# Altium schematic sheet MCU_Power.SchDoc
size A4; SheetNumber: 3; SheetTotal: 4
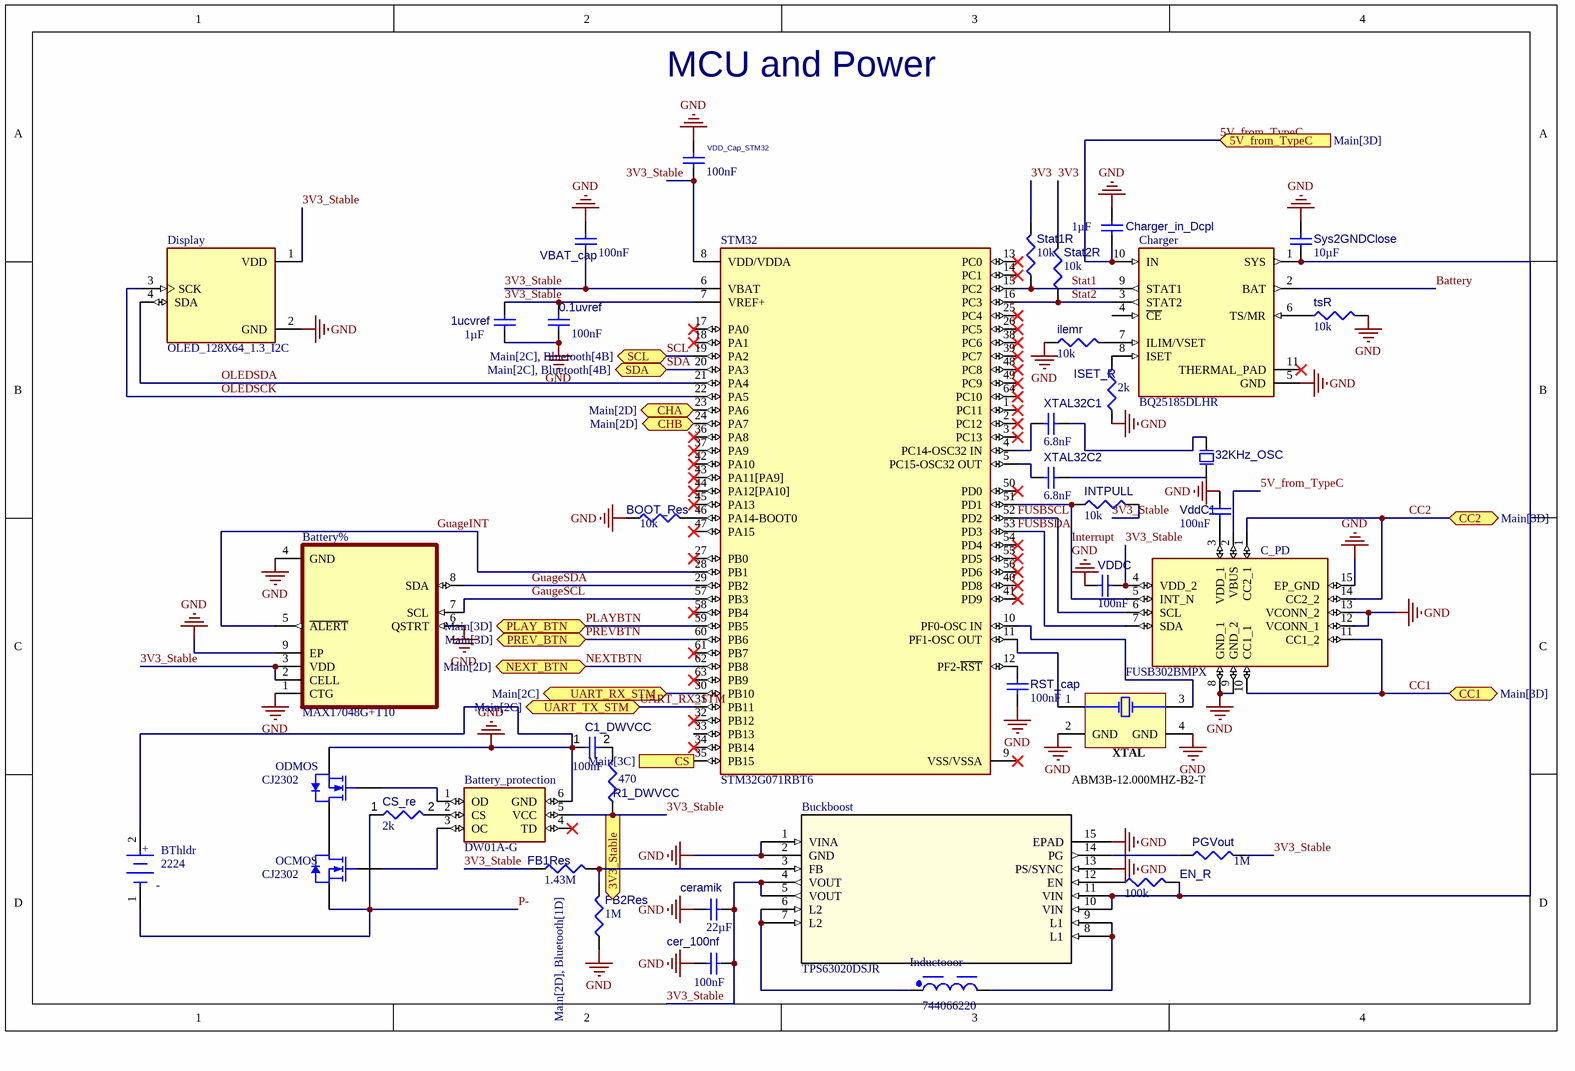
[diagram p0: MCU_Power.SchDoc]

## Parts
0.1uvref  value 100nF  [CAPC0402(1005)60_L]  (hidden comment: Capacitor 100nF +/-20% 10V 0402)
1ucvref  value 1µF  [CAPC2013X145X50ML20T25]  (hidden comment: Capacitor 1 uF +/- 10% 25 V 0805)
32KHz_OSC  ABS07-166-32.768KHZ-T  [EPSON-FC-135_V]  (value not drawn)
Battery%  MAX17048G+T10  [SON50P200X200X80-9N]
Battery_protection  DW01A-G  [SOT95P280X135-6N]
BOOT_Res  value 10k  [RESC0402(1005)_L]  (hidden comment: 10KR2F)
BThldr  2224  [FP-2224-MFG]
Buckboost  TPS63020DSJR  [IC_TPS63020DSJR]
C1_DWVCC  value 100nF  [CAPC0402(1005)60_L]  (hidden comment: Capacitor 100nF +/-20% 10V 0402)
C_PD  FUSB302BMPX  [QFN50P250X250X80-15N]
cer_100nf  value 100nF  [CAPC0402(1005)60_L]  (hidden comment: Capacitor 100nF +/-20% 50V 0402)
ceramik  value 22µF  [CAPC0805(2012)145_L]  (hidden comment: Capacitor 22µF +/-40% 16V 0805)
Charger  BQ25185DLHR  [IC_BQ25185DLHR]
Charger_in_Dcpl  value 1µF  [CAPC1005X55X25ML5T10]  (hidden comment: Capacitor 1 uF +/- 10% 6.3 V 1005)
CS_re  value 2k  [RESC0402(1005)_L]  (hidden comment: Resistor 2K +/-5 % 0402 63 mW)
Display  OLED_128X64_1.3_I2C  [LCD_OLED_128X64_1.3_I2C]
EN_R  value 100k  [RESC0402(1005)_L]  (hidden comment: 100KR2F)
FB1Res  value 1.43M  [RESC0402(1005)_L]  (hidden comment: Resistor 1M +/-1 % 0402 63 mW)
FB2Res  value 1M  [RESC0402(1005)_L]  (hidden comment: Resistor 1M +/-1 % 0402 63 mW)
ilemr  value 10k  [RESC0402(1005)_L]  (hidden comment: 10KR2F)
Inductooor  744066220  [WE-TPC_1038]
INTPULL  value 10k  [RESC0402(1005)_L]  (hidden comment: 10KR2F)
ISET_R  value 2k  [RESC0402(1005)_L]  (hidden comment: 2KR2J)
OCMOS  CJ2302  [JSCJ-SOT23-3_V]
ODMOS  CJ2302  [JSCJ-SOT23-3_V]
PGVout  value 1M  [RESC0402(1005)_L]  (hidden comment: Resistor 1M +/-1 % 0402 63 mW)
R1_DWVCC  value 470  [RESC0805(2012)_L]  (hidden comment: 470R5J)
RST_cap  value 100nF  [CAPC0402(1005)60_L]  (hidden comment: Capacitor 100nF +/-20% 10V 0402)
Stat1R  value 10k  [RESC0402(1005)_L]  (hidden comment: 10KR2F)
Stat2R  value 10k  [RESC0402(1005)_L]  (hidden comment: 10KR2F)
STM32  STM32G071RBT6  [FP-LQFP64-5W-IPC_C]
Sys2GNDClose  value 10µF  [CAPC3216X180X50NL20T25]  (hidden comment: Capacitor 10 uF +/- 10% 16 V 1206)
tsR  value 10k  [RESC0402(1005)_L]  (hidden comment: 10KR2F)
VBAT_cap  value 100nF  [CAPC0402(1005)60_L]  (hidden comment: Capacitor 100nF +/-20% 10V 0402)
VDD_Cap_STM32  value 100nF  [CAPC0402(1005)60_L]  (hidden comment: Capacitor 100nF +/-20% 10V 0402)
VDDC  value 100nF  [CAPC0402(1005)60_L]  (hidden comment: Capacitor 100nF +/-20% 10V 0402)
VddC1  value 100nF  [CAPC0402(1005)60_L]  (hidden comment: Capacitor 100nF +/-20% 10V 0402)
XTAL  ABM3B-12.000MHZ-B2-T  [ABRA-ABM3B-4_V]
XTAL32C1  value 6.8nF  [CAPC1005X56X25NL10T15]  (hidden comment: Capacitor 6.8 nF +/- 10% 16 V 0402)
XTAL32C2  value 6.8nF  [CAPC1005X56X25NL10T15]  (hidden comment: Capacitor 6.8 nF +/- 10% 16 V 0402)

## Ports
3V3_Stable (out, see Main[2D], Bluetooth[1D]), 5V_from_TypeC (in, see Main[3D]), CC1 (bidir, see Main[3D]), CC2 (bidir, see Main[3D]), CHA (bidir, see Main[2D]), CHB (bidir, see Main[2D]), CS (out, see Main[3C]), NEXT_BTN (bidir, see Main[2D]), PLAY_BTN (bidir, see Main[3D]), PREV_BTN (bidir, see Main[3D]), SCL (bidir, see Main[2C], Bluetooth[4B]), SDA (bidir, see Main[2C], Bluetooth[4B]), UART_RX_STM (bidir, see Main[2C]), UART_TX_STM (bidir, see Main[2C])

## Nets
GND: 0.1uvref.1 1ucvref.1 Battery%.1(CTG) Battery%.4(GND) Battery%.6(QSTRT) Battery%.9(EP) Battery_protection.6(GND) BOOT_Res.1 BThldr.2(A) Buckboost.1(VINA) Buckboost.2(GND) Buckboost.13(PS/SYNC) Buckboost.15(EPAD) C1_DWVCC.1 C_PD.8(GND_1) C_PD.9(GND_2) C_PD.12(VCONN_1) C_PD.13(VCONN_2) C_PD.15(EP_GND) cer_100nf.1 ceramik.1 Charger.5(GND) Charger_in_Dcpl.2 Display.2(GND) FB2Res.1 ilemr.1 ISET_R.1 ODMOS.2(S) RST_cap.2 Sys2GNDClose.2 tsR.2 VBAT_cap.2 VDD_Cap_STM32.2 VDDC.1 VddC1.2 XTAL.2(GND) XTAL.4(GND)
3V3: Stat1R.2 Stat2R.2
3V3_Stable: 0.1uvref.2 1ucvref.2 Battery%.2(CELL) Battery%.3(VDD) Battery_protection.5(VCC) Buckboost.4(VOUT) Buckboost.5(VOUT) C_PD.4(VDD_2) cer_100nf.2 ceramik.2 Display.1(VDD) FB1Res.1 INTPULL.2 PGVout.2 R1_DWVCC.1 STM32.6(VBAT) STM32.7(VREF+) VBAT_cap.1 VDDC.2 ; port 3V3_Stable
5V_from_TypeC: C_PD.2(VBUS) Charger.10(IN) Charger_in_Dcpl.1 ; port 5V_from_TypeC
Battery: Charger.2(BAT)
CC1: C_PD.10(CC1_1) C_PD.11(CC1_2) ; port CC1
CC2: C_PD.1(CC2_1) C_PD.14(CC2_2) ; port CC2
CHA: STM32.23(PA6) ; port CHA
CHB: STM32.24(PA7) ; port CHB
CS: STM32.35(PB15) ; port CS
FUSBSCL: C_PD.6(SCL) STM32.52(PD2)
FUSBSDA: C_PD.7(SDA) STM32.53(PD3)
GaugeSCL: Battery%.7(SCL) STM32.57(PB3)
GuageINT: Battery%.5(~{ALERT}) STM32.28(PB1)
GuageSDA: Battery%.8(SDA) STM32.29(PB2)
Interrupt: C_PD.5(INT_N) INTPULL.1 STM32.51(PD1)
NEXTBTN: STM32.62(PB8) ; port NEXT_BTN
OLEDSCK: Display.3(SCK) STM32.22(PA5)
OLEDSDA: Display.4(SDA) STM32.21(PA4)
P-: BThldr.1(C) CS_re.1 OCMOS.2(S)
PLAYBTN: STM32.59(PB5) ; port PLAY_BTN
PREVBTN: STM32.60(PB6) ; port PREV_BTN
SCL: STM32.19(PA2) ; port SCL
SDA: STM32.20(PA3) ; port SDA
Stat1: Charger.9(STAT1) Stat1R.1 STM32.15(PC2)
Stat2: Charger.3(STAT2) Stat2R.1 STM32.16(PC3)
UART_RX_STM: STM32.30(PB10) ; port UART_RX_STM
UART_RX_STM: STM32.31(PB11) ; port UART_TX_STM  [a separate net that carries the same name]
Net32KHz_OSC_1: 32KHz_OSC.1 XTAL32C2.2
Net32KHz_OSC_2: 32KHz_OSC.2 XTAL32C1.2
NetBattery_protection_1: Battery_protection.1(OD) ODMOS.1(G)
NetBattery_protection_2: Battery_protection.2(CS) CS_re.2
NetBattery_protection_3: Battery_protection.3(OC) OCMOS.1(G)
NetBOOT_Res_2: BOOT_Res.2 STM32.46(PA14-BOOT0)
NetBuckboost_3: Buckboost.3(FB) FB1Res.2 FB2Res.2
NetBuckboost_6: Buckboost.6(L2) Buckboost.7(L2) Inductooor.1
NetBuckboost_8: Buckboost.8(L1) Buckboost.9(L1) Inductooor.2
NetBuckboost_10: Buckboost.10(VIN) Buckboost.11(VIN) Charger.1(SYS) EN_R.2 Sys2GNDClose.1
NetBuckboost_12: Buckboost.12(EN) EN_R.1
NetBuckboost_14: Buckboost.14(PG) PGVout.1
NetC1_DWVCC_2: C1_DWVCC.2 R1_DWVCC.2
NetC_PD_3: C_PD.3(VDD_1) VddC1.1
NetCharger_6: Charger.6(TS/MR) tsR.1
NetCharger_7: Charger.7(ILIM/VSET) ilemr.2
NetCharger_8: Charger.8(ISET) ISET_R.2
NetOCMOS_3: OCMOS.3(D) ODMOS.3(D)
NetRST_cap_1: RST_cap.1 STM32.12(PF2-~{RST})
NetSTM32_4: STM32.4(PC14-OSC32_IN) XTAL32C1.1
NetSTM32_5: STM32.5(PC15-OSC32_OUT) XTAL32C2.1
NetSTM32_8: STM32.8(VDD/VDDA) VDD_Cap_STM32.1
NetSTM32_10: STM32.10(PF0-OSC_IN) XTAL.3(X2)
NetSTM32_11: STM32.11(PF1-OSC_OUT) XTAL.1(X1)

Not connected (* = marked no-connect by the designer): Battery_protection 4(TD)*; Charger 4(~{CE}) 11(THERMAL_PAD)*; STM32 1(PC11)* 2(PC12)* 3(PC13)* 9(VSS/VSSA)* 13(PC0)* 14(PC1)* 17(PA0)* 18(PA1)* 25(PC4)* 26(PC5)* 27(PB0)* 32(PB12)* 33(PB13) 34(PB14)* 36(PA8)* 37(PA9)* 38(PC6)* 39(PC7)* 40(PD8)* 41(PD9)* 42(PA10)* 43(PA11[PA9])* 44(PA12[PA10])* 45(PA13)* 47(PA15)* 48(PC8)* 49(PC9)* 50(PD0)* 54(PD4)* 55(PD5)* 56(PD6)* 58(PB4)* 61(PB7)* 63(PB9)* 64(PC10)*

## Notes on the sheet
- MCU and Power
- Labels drawn without touching a wire or pin: 3V3_Stable
- (in symbol CMP-19636-000012-1) +

## Library data of the parts
0.1uvref C1_DWVCC RST_cap VBAT_cap VDD_Cap_STM32 VDDC VddC1 = CMP-001-00061-3: Chip Capacitor, 100nF +/-20%, 10V, 0402, Thickness 0.6 mm; Tolerance: 20%; Mounting Technology: SMT; Voltage Rating: 10V; Max Operating Temperature: 85°C; Pins: 2; Case/Package: 0402; Min Operating Temperature: -55°C
1ucvref = CMP-001-00010-6: Chip Capacitor, 1 uF, +/-10%, 25 V, 0805 (2012 Metric); Capacitor Type: Ceramic; Voltage Rating: 25V; RoHS Compliant: True; Pins: 2; Mounting Technology: SM; Max Operating Temperature: 125°C; Min Operating Temperature: -55°C; Tolerance: 10%; Case/Package: 0805
32KHz_OSC = CMP-003-00029-1: Crystal 32.768kHz 10ppm 7pF -40C +85C; Pins: 2; Frequency: 32.768kHz
Battery% = CMP-013-000000-1: 3ÂµA 1-Cell/2-Cell Fuel Gauge with ModelGauge; MF: Analog Devices; Purchase-URL: https://pricing.snapeda.com/search/part/MAX17048G+T10/?ref=eda; Check_prices: https://www.snapeda.com/parts/MAX17048G+T10/Analog+Devices/view-part/?ref=eda; Pin Count: 9; Availability: In Stock; Value: *; MP: MAX17048G+T10; Component Type: Standard; SnapEDA_Link: https://www.snapeda.com/parts/MAX17048G+T10/Analog+Devices/view-part/?ref=snap; Design Item ID: MAX17048G+T10; Package: TDFN-8 Maxim; Source: MAX17048G+T10.SchLib; Price: None
Battery_protection = CMP-031-00007-1: One Cell Lithium-ion/Polymer Battery Protection IC; MF: Fortune; Design Item ID: DW01A-G; MP: DW01A-G; SnapEDA_Link: https://www.snapeda.com/parts/DW01A-G/Fortune+Semiconductor/view-part/?ref=snap; Pins: 6; Value: *; Source: DW01A-G.SchLib; Check_prices: https://www.snapeda.com/parts/DW01A-G/Fortune+Semiconductor/view-part/?ref=eda; Case/Package: None; Component Type: Standard
BOOT_Res ilemr INTPULL Stat1R Stat2R tsR = CMP-009-00066-2: 10K 0.063W 1% 0402 (1005 Metric)  SMD; Power: 63mW; Case/Package: 0402; Mounting Technology: SMT; Pins: 2; Tolerance: 1%
BThldr = CMP-19636-000012-1: BATTERY HOLDER C PC PIN; Number of Cells: 1; Case/Package: Aluminum; Series: -; Lead Free: Lead Free; RoHS Compliant: No; Termination: PC Pin; Number of Batteries: 1; Material: Polyethylene; REACH SVHC: No SVHC; Package Quantity: 1; Packaging: Bulk; Mount: Through Hole
Buckboost = TPS63020DSJR: High Efficiency Single Inductor Buck-Boost Converter with 4A Switch 14-VSON -40 to 125; Manufacturer_Name: Texas Instruments; Copyright: Copyright (C) 2025 Ultra Librarian. All rights reserved.; Manufacturer_Part_Number: TPS63020DSJR; RefDes: RefDes; Type: Type
C_PD = CMP-031-00006-1: USB Controller USB 3.1 USB Interface 14-MLP (2.5x2.5); MF: ON Semiconductor; Design Item ID: FUSB302BMPX; MP: FUSB302BMPX; Case/Package: WQFN-14 ON Semiconductor; Source: FUSB302BMPX.SchLib; Component Type: Standard; Value: *; Check_prices: https://www.snapeda.com/parts/FUSB302BMPX/Onsemi/view-part/?ref=eda; Pins: 15; SnapEDA_Link: https://www.snapeda.com/parts/FUSB302BMPX/Onsemi/view-part/?ref=snap
cer_100nf = CMP-001-00067-3: Chip Capacitor, 100nF +/-20%, 50V, 0402, Thickness 0.6 mm; Tolerance: 10%; Min Operating Temperature: -55°C; Pins: 2; Case/Package: 0402; Max Operating Temperature: 85°C; Voltage Rating: 50V; Mounting Technology: SMT
ceramik = CMP-001-00081-4: Chip Capacitor, 22µF +/-40%, 16V, 0805, Thickness 1.45 mm; Tolerance: 5%; Voltage Rating: 16V; Mounting Technology: SMT; Pins: 2; Max Operating Temperature: 85°C; Case/Package: 0805; Min Operating Temperature: -55°C
Charger = CMP-00029-00001-1: 1-cell, 1-A stand-alone linear battery charger with power path and solar input support; MF: Texas Instruments; Source: BQ25185DLHR.SchLib; Value: *; Pins: 11; Check_prices: https://www.snapeda.com/parts/BQ25185DLHR/Texas+Instruments/view-part/?ref=eda; MP: BQ25185DLHR; Design Item ID: BQ25185DLHR; Case/Package: WFDFN-10 Texas Instruments; Component Type: Standard; SnapEDA_Link: https://www.snapeda.com/parts/BQ25185DLHR/Texas+Instruments/view-part/?ref=snap
Charger_in_Dcpl = CMP-001-00009-6: Chip Capacitor, 1 uF, +/- 10%, 6.3 V, 1005 (0402 Metric); Voltage Rating: 6.3V; Capacitor Type: Ceramic; Min Operating Temperature: -55°C; Case/Package: 0402; Tolerance: 10%; Mounting Technology: SM; Max Operating Temperature: 85°C; RoHS Compliant: True; Pins: 2
CS_re = CMP-009-00138-3: Chip Resistor, 2 kOhms, +/-5 %, 63 mW, -55 to 155 degC, 0402; Tolerance: 5%; Power: 63mW; Max Operating Temperature: 155°C; Pins: 2; Min Operating Temperature: -55°C; Case/Package: 0402
Display = CMP-007-00036-1: Non-Touch Graphic LCD Display Module Transmissive White OLED, Monochrome I2C 1.3 (33.02mm) 128 x 64; MF: UNIVERSAL-SOLDER Electronics Ltd; MP: OLED 128x64 1.3&quot; I2C; Source: OLED_128X64_1.3_I2C.SchLib; Case/Package: None; Value: *; Component Type: Standard; Pins: 4; Check_prices: https://www.snapeda.com/parts/OLED%20128x64%201.3%22%20I2C/UNIVERSAL-SOLDER+Electronics+Ltd/view-part/?ref=eda; Design Item ID: OLED_128X64_1.3_I2C; SnapEDA_Link: https://www.snapeda.com/parts/OLED%20128x64%201.3%22%20I2C/UNIVERSAL-SOLDER+Electronics+Ltd/view-part/?ref=snap
EN_R = CMP-009-00064-2: 100K 0.063W 1% 0402 (1005 Metric)  SMD; Power: 63mW; Case/Package: 0402; Mounting Technology: SMT; Pins: 2; Tolerance: 1%
FB1Res FB2Res PGVout = CMP-009-00165-3: Chip Resistor, 1 MOhms, +/-1 %, 63 mW, -55 to 155 degC, 0402; Tolerance: 1%; Power: 63mW; Case/Package: 0402; Pins: 2
Inductooor = CMP-0227-00103-4: Power Choke Shielded Wirewound 22uH 30% 100KHz Ferrite 2.6A 0.075Ohm DCR T/R; Max DC Current: 2.5A; Resistance: 60mΩ; Inductance: 22µH; DC Resistance (DCR): 55.8mΩ; Self Resonant Frequency: 12MHz; Saturation Current: 2.3A; Length: 10mm; Composition: Wirewound; Inductance Tolerance: 30%; Test Frequency: 100kHz; Core Material: Ferrite; Max Operating Temperature: 125°C; Tolerance: 30%; RoHS: Compliant; Height: 3.8mm; Lead Free: Lead Free; Shielding: Shielded; Termination: SMD/SMT; Number of Pins: 2; Current Rating: 2.5A; Ambient Temperature Range High: 95°C; Ambient Temperature Range Low: -40°C; Weight: 1.273007g; Case/Package: Nonstandard; Mount: Surface Mount; Height - Seated (Max): 4.0894mm; RMS Current (Irms): 2.5A; Width: 10mm; Min Operating Temperature: -40°C; Depth: 10mm
ISET_R = CMP-009-00091-2: 2K 0.063W 5% 0402 (1005 Metric)  SMD; Power: 63mW; Case/Package: 0402; Mounting Technology: SMT; Tolerance: 5%; Pins: 2
OCMOS ODMOS = CMP-013-00014-3: N-Channe Plastic Encapsulate MOSFET, 20 V, 2.1 A, 3-Pin SOT23, Tape and Reel; Manufacturer: Jiangsu Changjiang Electronics Technology; Package Version: Rev. E, 09/2009; Package Reference: SOT23-3; Mounting Technology: SM; Datasheet Version: Rev. D, 08/2015; RoHS Compliant: Unknown; Package Description: 3-Pin Small Outline Transistor, Body 2.9 x 1.3 mm, Pitch 0.95 mm; Datasheet URL: http://www.cj-elec.com/gallery/txUpfile/9c19fa03e8d43801a6647d386a41a240.pdf; Case/Package: SOT23-3
R1_DWVCC = CMP-009-00102-2: 470R 0.125W 5% 0805 (2012 Metric)  SMD; Power: 125mW; Pins: 2; Case/Package: 0805; Mounting Technology: SMT; Tolerance: 5%
STM32 = CMP-12105-000141-1: IC MCU 32BIT 128KB FLASH 64LQFP; Core Architecture: ARM; Frequency: 64MHz; Interface: I2C; Peripherals: Brown-out Detect/Reset; Oscillator Type: Internal; Number of I/Os: 66; Case/Package: LQFP; Max Operating Temperature: 85°C; RoHS Compliant: Yes; Memory Size: 128KB; Packaging: Tray; Min Operating Temperature: -40°C; Memory Type: FLASH
Sys2GNDClose = CMP-001-00016-6: Chip Capacitor, 10 uF, +/- 10%, 16 V, 1206 (3216 Metric); Capacitor Type: Ceramic; Voltage Rating: 16V; Tolerance: 10%; Min Operating Temperature: -55°C; Pins: 2; Mounting Technology: SM; Case/Package: 1206; Max Operating Temperature: 125°C; RoHS Compliant: True
XTAL = CMP-003-00015-2: Ceramic SMD Crystal, 12 MHz, +/- 20 ppm, 18 pF, -20 to 70 degC, 4-Pin SMD, RoHS, Tape and Reel; Manufacturer: Abracon; ESR: 70; Load Capacitance: 18pF; Tolerance: 20ppm; Frequency: 12MHz; Resistance: 70Ohm; Mounting Technology: SM; Packaging: TapeandReel; Datasheet URL: http://www.abracon.com/Resonators/abm3b.pdf; Manufacturer URL: http://www.abracon.com/; RoHS Compliant: True; Frequency Tolerance: 20ppm; Datasheet Version: Aug-15; Max Operating Temperature: 70°C; Package Reference: ABM3B; Min Operating Temperature: -20°C; Pins: 4; Package Quantity: 1000; Package Description: 4-Pin Surface Mount Device, Body 5 x 3.2 mm; Case/Package: CSMD
XTAL32C1 XTAL32C2 = CMP-001-00000-6: Chip Capacitor, 6.8 nF, +/- 10%, 16 V, 0402 (1005 Metric); Capacitor Type: Ceramic; Voltage Rating: 16V; RoHS Compliant: True; Pins: 2; Case/Package: 0402; Min Operating Temperature: -55°C; Tolerance: 10%; Mounting Technology: SM; Max Operating Temperature: 125°C